# EAGLE design Nanofeed V2 (EAGLE 9.3.0)
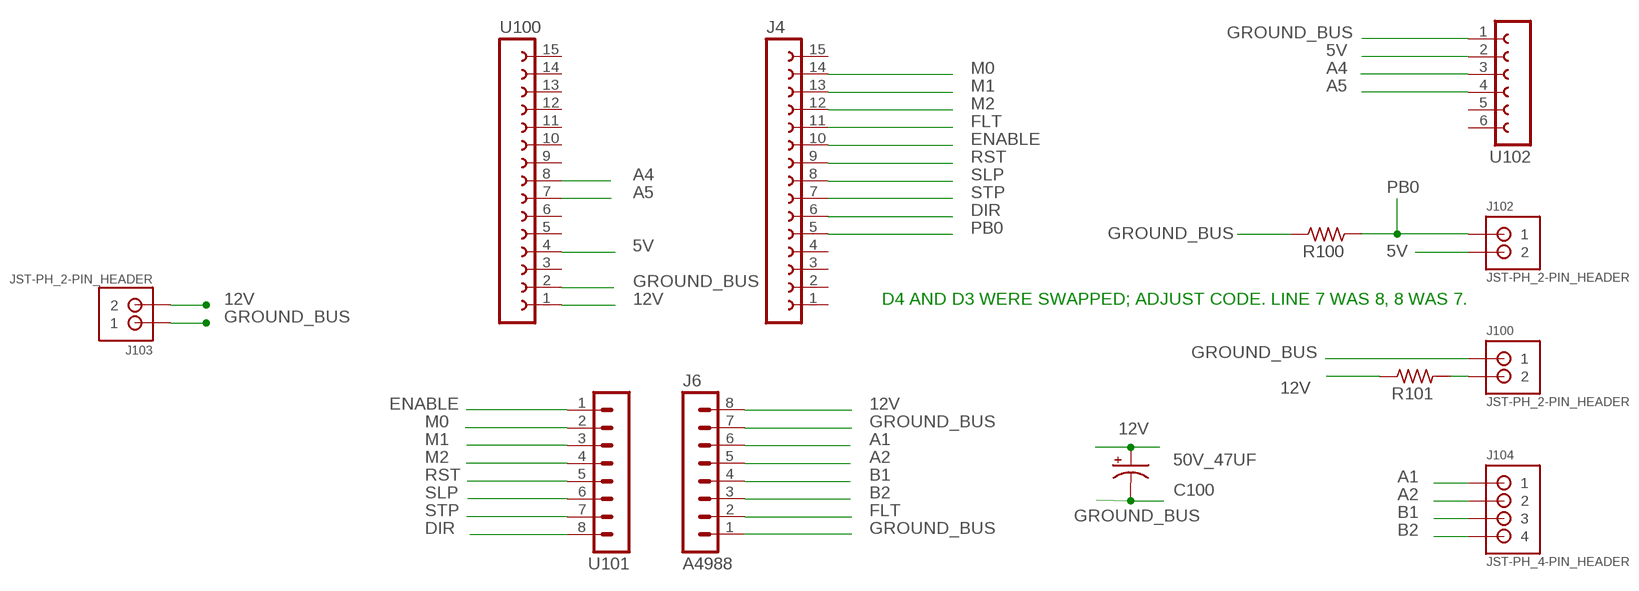
[diagram p0: schematic, sheet 1]

## Parts
C100  50V_47UF  47UF-POLAR-PANASONIC_D-50V-20%  [PANASONIC_D]
J4  FE15-1  [FE15]
J6  A4988  MA08-1  [MA08-1]
J100  JST-PH_2-PIN_HEADER  [JST_B2B-PH_HEADER]
J102  JST-PH_2-PIN_HEADER  [JST_B2B-PH_HEADER]
J103  JST-PH_2-PIN_HEADER  [JST_B2B-PH_HEADER]
J104  JST-PH_4-PIN_HEADER  [JST_B4B-PH_HEADER]
R100  R_5025  [R5025]
R101  R_5025  [R5025]
U100  FE15-1  [FE15]
U101  MA08-1  [MA08-1]
U102  FE06-1  [FE06]

## Nets
5V: J102.P2 U100.4 U102.2
12V: C100.+ J6.8 J103.P2 R101.2 U100.1
A1: J6.6 J104.P1
A2: J6.5 J104.P2
A4: U100.8 U102.3
A5: U100.7 U102.4
B1: J6.4 J104.P3
B2: J6.3 J104.P4
DIR: J4.6 U101.8
ENABLE: J4.10 U101.1
FLT: J4.11 J6.2
GROUND_BUS: C100.- J6.1 J100.P1 J103.P1 R100.2 U100.2 U102.1
M0: J4.14 U101.2
M1: J4.13 U101.3
M2: J4.12 U101.4
N$4: J6.7
N$12: J100.P2 R101.1
PB0: J4.5 J102.P1 R100.1
RST: J4.9 U101.5
SLP: J4.8 U101.6
STP: J4.7 U101.7
Unconnected: J4.1 J4.2 J4.3 J4.4 J4.15 U100.3 U100.5 U100.6 U100.9 U100.10 U100.11 U100.12 U100.13 U100.14 U100.15 U102.5 U102.6

## Notes on the sheet
- D4 AND D3 WERE SWAPPED; ADJUST CODE. LINE 7 WAS 8, 8 WAS 7.

## Library data of the parts
C100 = SparkFun-Capacitors:47UF-POLAR: 47µF polarized capacitors A capacitor is a passive two-terminal electrical component used to store electrical energy temporarily in an electric field.
J4 U100 = con-lsta:FE15-1: FEMALE HEADER; OC_FARNELL: unknown; OC_NEWARK: unknown
J6 U101 = con-lstb:MA08-1: PIN HEADER; OC_FARNELL: unknown; OC_NEWARK: unknown
J100 J102 J103 = SRG:JST-PH_2-PIN_HEADER: 2-pin JST PH Shrouded Header, top entry P/N B2B-PH-K-S Mating connector PHR-2 Mating cable assembly: Sparkfun PRT-09914 <http://www.sparkfun.com/products/9914>
J104 = SRG:JST-PH_4-PIN_HEADER: 4-pin JST PH Shrouded Header, top entry P/N B4B-PH-K-S Mating connector PHR-4 Mating cable assembly: Sparkfun PRT-09916 <http://www.sparkfun.com/products/9916>
R100 R101 = rc-master-smd:R_: RESISTOR
U102 = con-lsta A:FE06-1: FEMALE HEADER; OC_FARNELL: unknown; OC_NEWARK: unknown

## Board
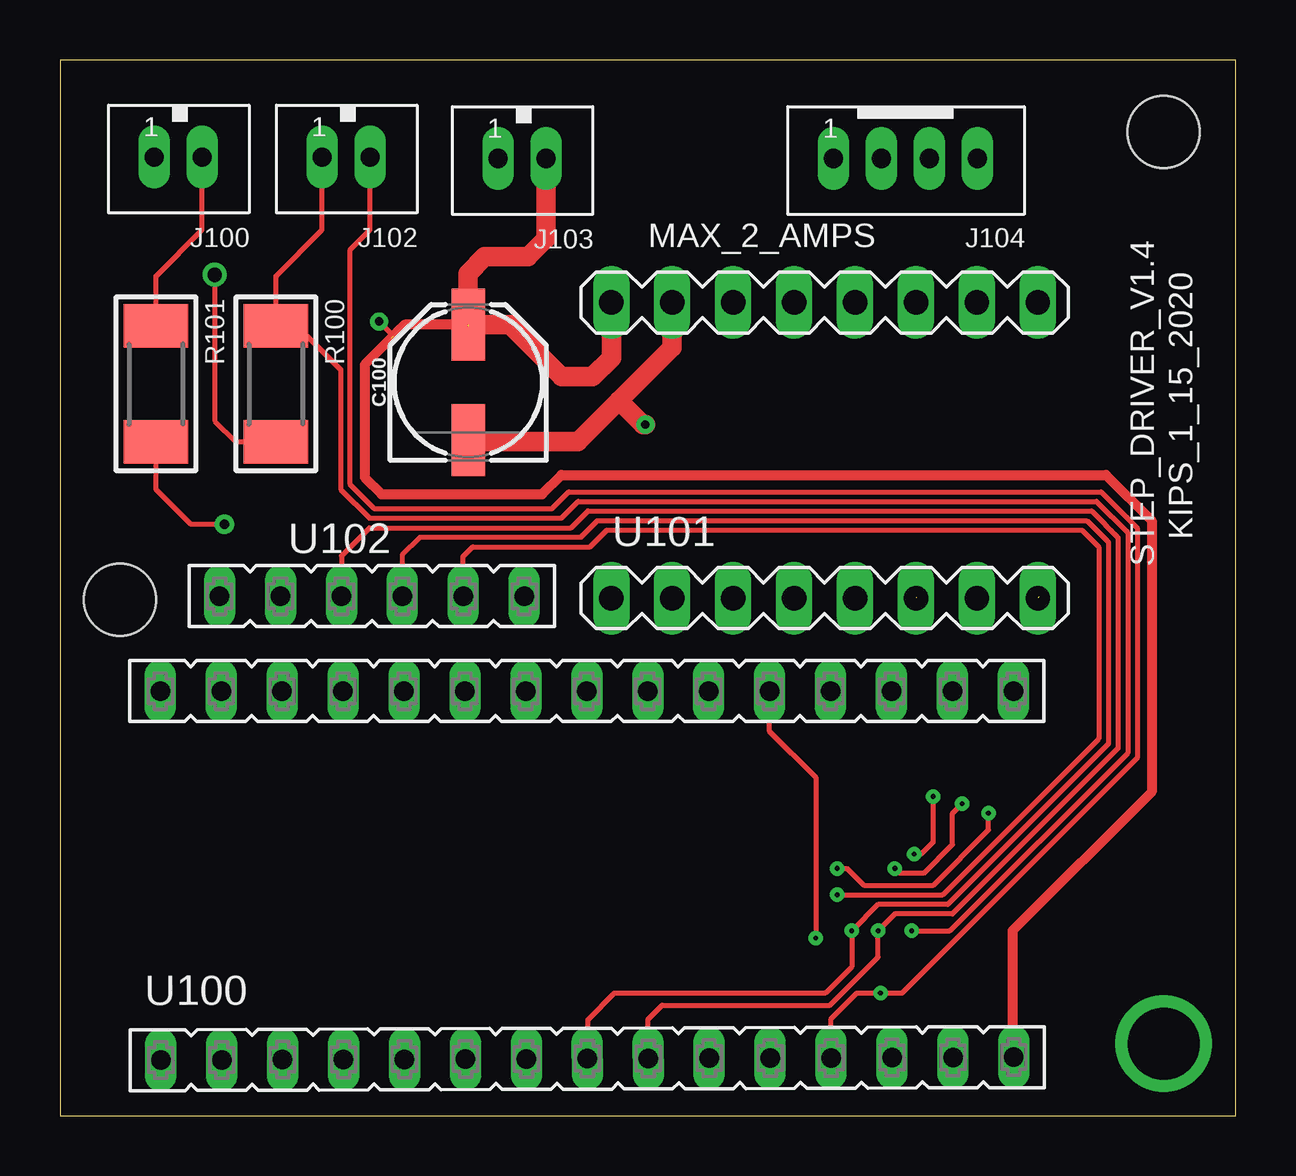
[diagram p1: board, top side]
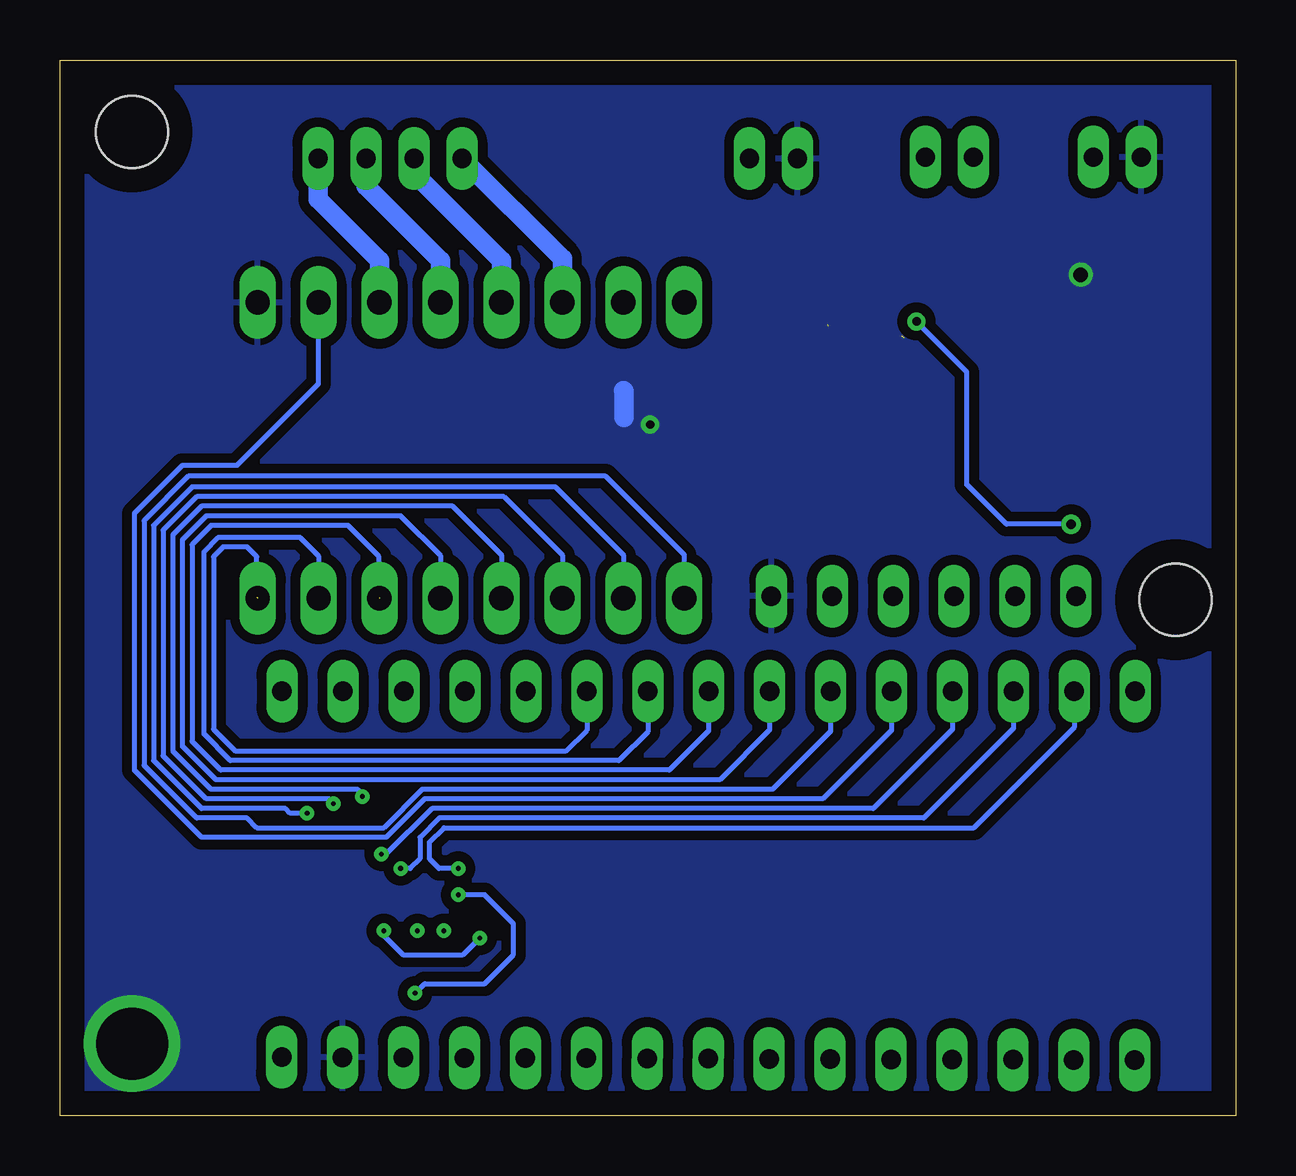
[diagram p2: board, bottom side, seen from below]

Size 49 x 44 mm. Coordinates in mm from the lower left corner, seen from the top.
Outline: 0,0 49,0 49,44 0,44 0,0
Copper layers (1*16): Top 0.035mm / dielectric 1.5mm / Bottom 0.035mm
Design rules "default": minimum track width 6mil, minimum drill 0.35mm, track to track 6mil, track to pad 6mil, pad to pad 6mil, via to via 6mil, smd to smd 6mil, copper to edge 40mil, drill to drill 6mil, minimum pad ring 10mil, minimum via ring 8mil, stop-mask expansion 4mil, vias tented up to drill 0mil, thermal gap 10mil
Holes 3 mm at 46,41 2.5,21.5

### Footprints (pad centres in the part's own frame; a part is rotated, then mirrored left to right if it is on the bottom)
PANASONIC_D = smd 3 x 1.4: + 2.4,0; - -2.4,0
FE15 = drill 0.813 long: 1 -17.78,0; 2 -15.24,0; 3 -12.7,0; 4 -10.16,0; 5 -7.62,0; 6 -5.08,0; 7 -2.54,0; 8 0,0; 9 2.54,0; 10 5.08,0; 11 7.62,0; 12 10.16,0; 13 12.7,0; 14 15.24,0; 15 17.78,0
MA08-1 = drill 1.016 long: 1 -8.89,0; 2 -6.35,0; 3 -3.81,0; 4 -1.27,0; 5 1.27,0; 6 3.81,0; 7 6.35,0; 8 8.89,0
JST_B2B-PH_HEADER = drill 0.8 long: P1 1.075,0.048; P2 -0.925,0.048
JST_B4B-PH_HEADER = drill 0.8 long: P1 2.98,0.048; P2 0.98,0.048; P3 -1.02,0.048; P4 -3.02,0.048
R5025 = smd 1.8 x 2.7: 1 -2.413,0; 2 2.413,0
FE06 = drill 0.813 long: 1 -6.35,0; 2 -3.81,0; 3 -1.27,0; 4 1.27,0; 5 3.81,0; 6 6.35,0

### Placement (x,y rotation side)
C100  17.02,30.56 90 top
J4  21.96,17.69 180 top
J6  31.87,33.89 180 top
J100  5,40 180 top
J102  12,40 180 top
J103  19.33,39.94 180 top
J104  35.22,39.94 180 top
R100  9,30.5 270 top
R101  4,30.5 270 top
U100  21.98,2.37 180.2 top
U101  31.87,21.57 0 top
U102  13,21.65 180 top

### Tracks (layer width: path | path; a pad name or v marks a point on that pad's centre or on a via)
5V  (via drill 0.2)
  Top 0.2: J102.P2 12.93,36.92 12.1,36.1 12.1,26.3 13.1,25.3 20.5,25.3 21.2,26 43.4,26 44.9,24.5 44.9,14.9 35.1,5.1 v34.2,5.1 33.2,5.1 32.14,4.04 U100.4 | U102.2 16.81,23.29 16.8,23.3 17.2,23.7 22.1,23.7 22.8,24.4 42.6,24.4 43.3,23.7 43.3,15.7 36.8,9.2 v32.4,9.2
  Bottom 0.2: v34.2,5.1 33.8,5.5 31.3,5.5 30.1,6.7 30.1,8 31.3,9.2 v32.4,9.2
12V  (via drill 0.35, 0.4)  (2 unrouted)
  Top 0.2: v6.85,24.65 5.45,24.65 4,26.1 R101.2 | v13.3,33.1 13.9,32.5
  Top 0.406: 13.9,32.5 14.2,32.8 14.36,32.96 C100.+ | 13.8,32.41 12.7,31.3 12.7,26.6 13.4,25.9 20.1,25.9 20.9,26.7 43.6,26.7 45.5,24.8 45.5,13.5 39.7,7.7 39.7,2.49 U100.1
  Top 0.813: J103.P2 20.25,36.55 19.5,35.8 17.7,35.8 17,35.1 17,32.9 | C100.+ 18.74,32.96 20.9,30.8 22.2,30.8 22.98,31.58 J6.8
  Bottom 0.2: v13.3,33.1 11.2,31 11.2,26.3 9.55,24.65 v6.85,24.65
  Bottom 0.813: J103.P2 20.25,40.19
A1
  Bottom 0.813: J6.6 28.06,35.71 J104.P1
A2
  Bottom 0.813: J6.5 30.6,35.64 34.24,39.28 J104.P2
A4  (via drill 0.2)
  Top 0.2: U100.8 22,2.39 22,4 23.1,5.1 31.9,5.1 33,6.2 v33,7.7 34.1,8.8 37,8.8 43.7,15.5 43.7,23.9 42.8,24.8 22.4,24.8 21.7,24.1 15,24.1 14.27,23.37 U102.3
A5  (via drill 0.2)
  Top 0.2: U100.7 24.52,4.02 25.1,4.6 32.1,4.6 34.1,6.6 v34.1,7.7 34.8,8.4 37.2,8.4 44.1,15.3 44.1,24.1 43,25.2 22,25.2 21.3,24.5 12.9,24.5 11.73,23.33 U102.4
B1
  Bottom 0.813: J6.4 33.14,35.64 36.24,38.74 J104.P3
B2
  Bottom 0.813: J6.3 35.68,35.64 38.24,38.2 J104.P4
DIR  (1 unrouted)
  Bottom 0.2: J4.6 27.04,16.06 27.9,15.2 41.7,15.2 42.6,16.1 42.6,23.3 42.2,23.7 41.2,23.7 40.8,23.3 40.8,21.61
ENABLE
  Bottom 0.2: J4.10 16.88,16.02 19.3,13.6 33.9,13.6 35.5,12 40.8,12 41.2,12.4 43.3,12.4 45.5,14.6 45.5,24.8 43.65,26.65 26.25,26.65 22.98,23.38 U101.1
FLT
  Bottom 0.2: J4.11 14.34,16.06 17.2,13.2 33.8,13.2 35.4,11.6 43.1,11.6 45.9,14.4 45.9,25.1 43.9,27.1 41.63,27.1 38.22,30.51 J6.2
GROUND_BUS  (via drill 0.35, 0.6, 3)
  Top 0.2: v6.45,35.05 6.45,28.95 7.31,28.09 R100.2
  Top 0.61: 3.98,39.9 J100.P1
  Top 0.813: C100.- 17.08,28.1 21.6,28.1 23.3,29.8 | 23.3,29.8 25.52,32.02 25.52,33.88 25.5,33.9 | 23.3,29.8 24.3,28.8 v24.4,28.8
  Bottom 0.813: 25.52,30.22 25.5,30.2 25.5,29.1
  other vias: 46,3
  pour Bottom (isolate 0.406): -0.2,44.1 -0.2,-0.35 49.2,-0.35 49.35,-0.2 49.35,44.25 -0.05,44.25
M0  (via drill 0.2)
  Top 0.2: v32.4,10.3 32.8,10.3 33.5,9.6 36.4,9.6 38.7,11.9 v38.7,12.6
  Bottom 0.2: J4.14 6.72,16.18 10.9,12 33,12 33.6,11.4 33.6,10.7 33.2,10.3 v32.4,10.3 | v38.7,12.6 39.4,12.6 39.6,12.8 43.1,12.8 45.1,14.8 45.1,24.6 43.5,26.2 28.35,26.2 25.52,23.37 U101.2
M1  (via drill 0.2)
  Top 0.2: v34.8,10.3 35,10.1 36,10.1 37.2,11.3 37.2,12.6 v37.6,13
  Bottom 0.2: J4.13 9.26,16.14 13,12.4 33.2,12.4 34,11.6 34,10.7 34.4,10.3 v34.8,10.3 | v37.6,13 37.8,13.2 42.9,13.2 44.7,15 44.7,24.4 43.3,25.8 30.5,25.8 28.06,23.36 U101.3
M2  (via drill 0.2)
  Top 0.2: v35.6,10.9 35.9,10.9 36.4,11.4 v36.4,13.3
  Bottom 0.2: J4.12 11.8,16.1 15.1,12.8 33.5,12.8 35.4,10.9 v35.6,10.9 | v36.4,13.3 36.4,13.4 36.6,13.6 42.7,13.6 44.3,15.2 44.3,24.2 43.1,25.4 32.63,25.4 30.6,23.37 U101.4
N$12
  Top 0.2: R101.1 4,35 5.92,36.92 J100.P2
PB0  (via drill 0.2)
  Top 0.2: J102.P1 10.93,36.92 9,35 R100.1 9.89,32.91 11.7,31.1 11.7,26.1 12.9,24.9 20.9,24.9 21.6,25.6 43.2,25.6 44.5,24.3 44.5,15.1 37.1,7.7 v35.5,7.7 | v31.5,7.4 31.5,14.1 29.58,16.02 J4.5
  Top 0.61: 9,32.75 R100.1
  Bottom 0.2: v35.5,7.7 35.5,7.5 34.7,6.7 32.2,6.7 v31.5,7.4
RST
  Bottom 0.2: J4.9 19.42,16.08 21.5,14 42.5,14 43.9,15.4 43.9,24 42.9,25 34.8,25 33.14,23.34 U101.5
SLP  (1 unrouted)
  Bottom 0.2: 35.7,21.59 35.7,23.3 37,24.6 42.7,24.6 43.5,23.8 43.5,15.6 42.3,14.4 23.6,14.4 21.96,16.04 J4.8
STP
  Bottom 0.2: J4.7 24.5,16 25.7,14.8 41.9,14.8 43,15.9 43,23.5 42.4,24.1 39,24.1 38.22,23.32 U101.7

### Text on the board
tNames: MAX_2_AMPS | KIPS_1_15_2020 | STEP_DRIVER_V1.4